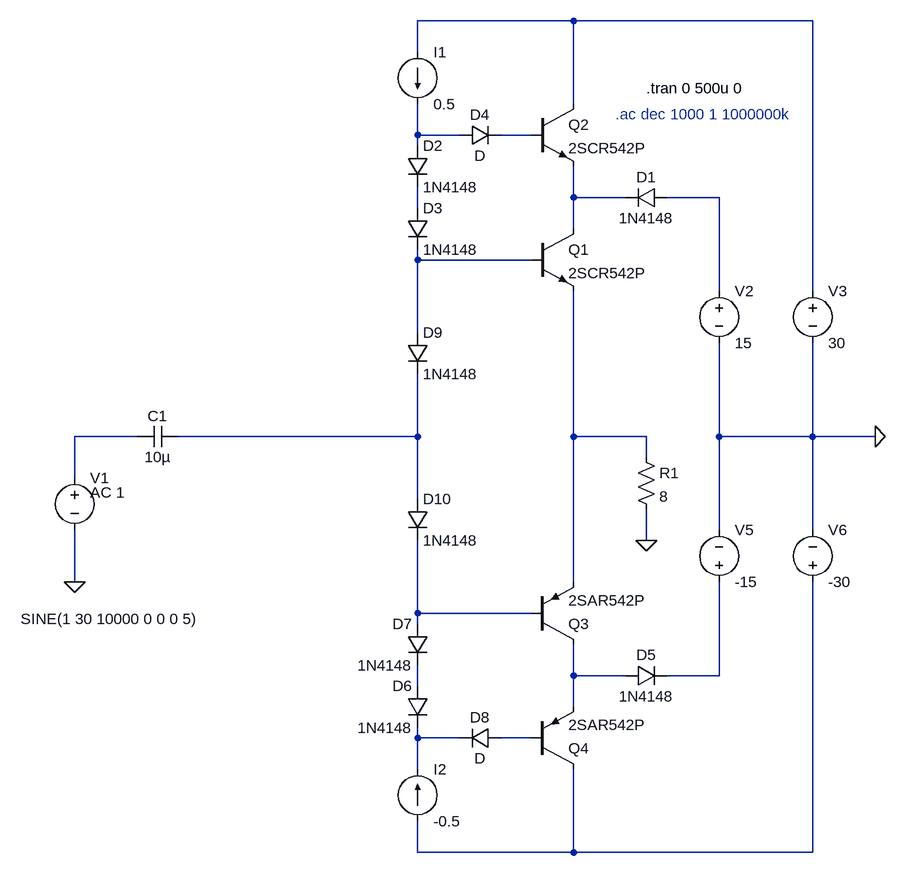
[diagram p0: schematic ClaseG_Basico_NPN_PNP.asc]
ClaseG_Basico_NPN_PNP.asc, the LTspice schematic file:
Version 4
SHEET 1 1112 1264
WIRE 464 -48 224 -48
WIRE 832 -48 464 -48
WIRE 224 0 224 -48
WIRE 464 80 464 -48
WIRE 224 128 224 80
WIRE 288 128 224 128
WIRE 400 128 352 128
WIRE 224 144 224 128
WIRE 464 224 464 176
WIRE 544 224 464 224
WIRE 688 224 608 224
WIRE 224 240 224 208
WIRE 464 272 464 224
WIRE 224 320 224 304
WIRE 400 320 224 320
WIRE 688 368 688 224
WIRE 832 368 832 -48
WIRE 224 432 224 320
WIRE -208 592 -304 592
WIRE 224 592 224 496
WIRE 224 592 -144 592
WIRE 464 592 464 368
WIRE 576 592 464 592
WIRE 688 592 688 448
WIRE 832 592 832 448
WIRE 832 592 688 592
WIRE 928 592 832 592
WIRE 576 624 576 592
WIRE -304 656 -304 592
WIRE 224 688 224 592
WIRE 688 736 688 592
WIRE 832 736 832 592
WIRE 576 752 576 704
WIRE -304 816 -304 736
WIRE 464 816 464 592
WIRE 224 864 224 752
WIRE 400 864 224 864
WIRE 224 880 224 864
WIRE 464 960 464 912
WIRE 544 960 464 960
WIRE 688 960 688 816
WIRE 688 960 608 960
WIRE 224 976 224 944
WIRE 464 1008 464 960
WIRE 224 1056 224 1040
WIRE 288 1056 224 1056
WIRE 400 1056 352 1056
WIRE 224 1104 224 1056
WIRE 224 1232 224 1184
WIRE 464 1232 464 1104
WIRE 464 1232 224 1232
WIRE 832 1232 832 816
WIRE 832 1232 464 1232
FLAG -304 816 0
FLAG 576 752 0
FLAG 928 592 0
SYMBOL npn 400 272 R0
SYMATTR InstName Q1
SYMATTR Value 2SCR542P
SYMBOL npn 400 80 R0
SYMATTR InstName Q2
SYMATTR Value 2SCR542P
SYMBOL diode 608 208 R90
WINDOW 0 0 32 VBottom 2
WINDOW 3 32 32 VTop 2
SYMATTR InstName D1
SYMATTR Value 1N4148
SYMBOL voltage -304 640 R0
WINDOW 3 -83 233 Left 2
WINDOW 123 24 38 Left 2
SYMATTR Value SINE(1 30 10000 0 0 0 5)
SYMATTR InstName V1
SYMATTR Value2 AC 1
SYMBOL voltage 688 352 R0
SYMATTR InstName V2
SYMATTR Value 15
SYMBOL voltage 832 352 R0
SYMATTR InstName V3
SYMATTR Value 30
SYMBOL res 560 608 R0
SYMATTR InstName R1
SYMATTR Value 8
SYMBOL current 224 0 R0
SYMATTR InstName I1
SYMATTR Value 0.5
SYMBOL diode 208 144 R0
SYMATTR InstName D2
SYMATTR Value 1N4148
SYMBOL diode 208 240 R0
SYMATTR InstName D3
SYMATTR Value 1N4148
SYMBOL diode 288 144 R270
WINDOW 0 32 32 VTop 2
WINDOW 3 0 32 VBottom 2
SYMATTR InstName D4
SYMBOL diode 544 944 M90
WINDOW 0 0 32 VBottom 2
WINDOW 3 32 32 VTop 2
SYMATTR InstName D5
SYMATTR Value 1N4148
SYMBOL voltage 688 832 M180
WINDOW 0 24 96 Left 2
WINDOW 3 24 16 Left 2
SYMATTR InstName V5
SYMATTR Value -15
SYMBOL voltage 832 832 M180
WINDOW 0 24 96 Left 2
WINDOW 3 24 16 Left 2
SYMATTR InstName V6
SYMATTR Value -30
SYMBOL current 224 1184 M180
WINDOW 0 24 80 Left 2
WINDOW 3 24 0 Left 2
SYMATTR InstName I2
SYMATTR Value -0.5
SYMBOL diode 240 976 M0
SYMATTR InstName D6
SYMATTR Value 1N4148
SYMBOL diode 240 880 M0
SYMATTR InstName D7
SYMATTR Value 1N4148
SYMBOL diode 352 1072 M270
WINDOW 0 32 32 VTop 2
WINDOW 3 0 32 VBottom 2
SYMATTR InstName D8
SYMBOL pnp 400 912 M180
SYMATTR InstName Q3
SYMATTR Value 2SAR542P
SYMBOL pnp 400 1104 M180
SYMATTR InstName Q4
SYMATTR Value 2SAR542P
SYMBOL diode 208 432 R0
SYMATTR InstName D9
SYMATTR Value 1N4148
SYMBOL diode 208 688 R0
SYMATTR InstName D10
SYMATTR Value 1N4148
SYMBOL cap -144 576 R90
WINDOW 0 0 32 VBottom 2
WINDOW 3 32 32 VTop 2
SYMATTR InstName C1
SYMATTR Value 10µ
TEXT 576 56 Left 2 !.tran 0 500u 0
TEXT 528 96 Left 2 ;.ac dec 1000 1 1000000k

The netlist it stands for:
* ClaseG_Basico_NPN_PNP.asc
Q1 N004 N007 N010 0 2SCR542P
Q2 N001 N003 N004 0 2SCR542P
D1 N005 N004 1N4148
V1 N008 0 SINE(1 30 10000 0 0 0 5) AC 1
V2 N005 0 15
V3 N001 0 30
R1 N010 0 8
I1 N001 N002 0.5
D2 N002 N006 1N4148
D3 N006 N007 1N4148
D4 N002 N003 D
D5 N012 N013 1N4148
V5 N013 0 -15
V6 N017 0 -30
I2 N017 N015 -0.5
D6 N014 N015 1N4148
D7 N011 N014 1N4148
D8 N016 N015 D
Q3 N012 N011 N010 0 2SAR542P
Q4 N017 N016 N012 0 2SAR542P
D9 N007 N009 1N4148
D10 N009 N011 1N4148
C1 N009 N008 10µ
.model D D
.lib standard.dio
.model NPN NPN
.model PNP PNP
.lib standard.bjt
.tran 0 500u 0
* .ac dec 1000 1 1000000k
.backanno
.end